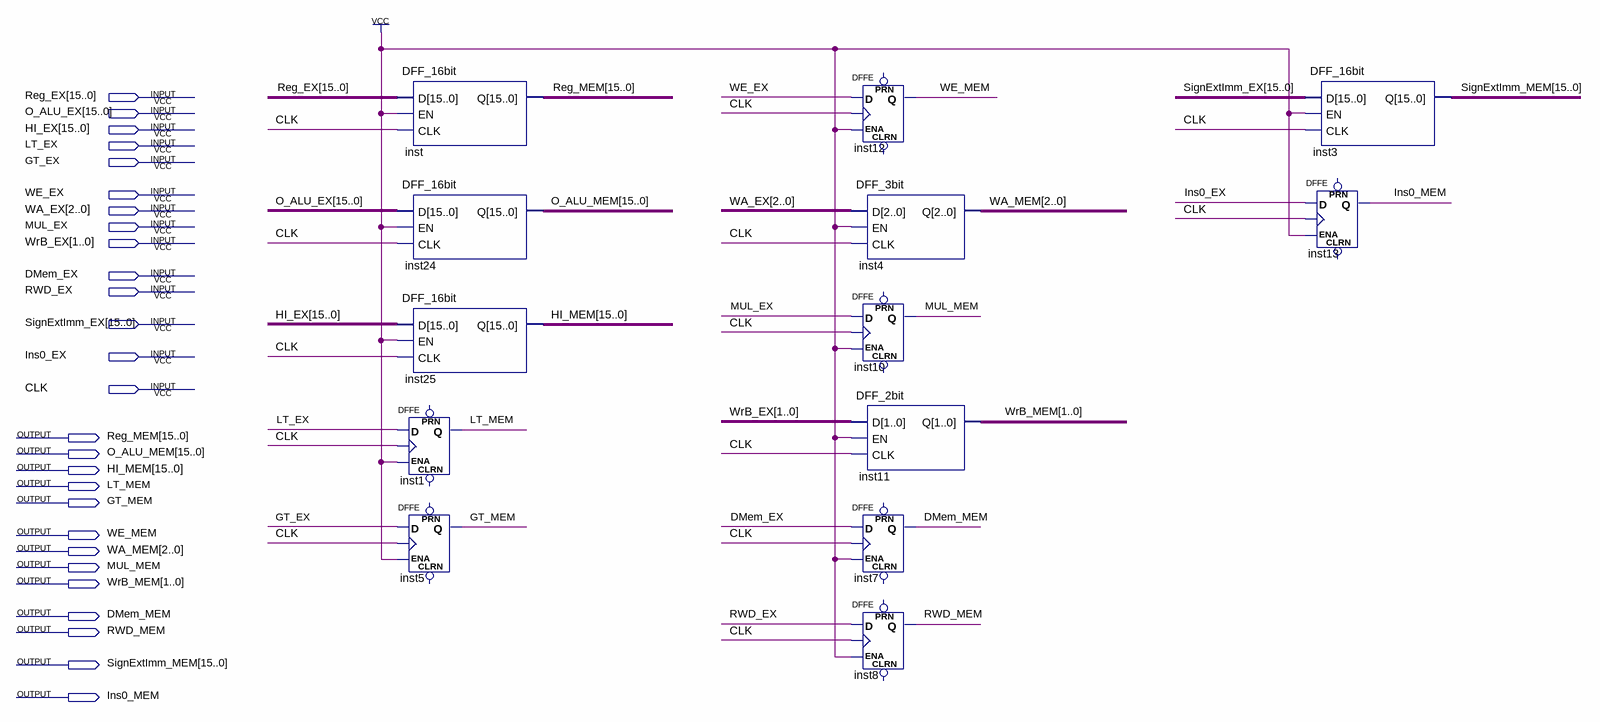
[diagram p0: schematic sheet]
// Quartus schematic EX_MEM.bdf as structural Verilog: 13 symbols, 27 pins
module EX_MEM (
  input  [15:0] Reg_EX,
  input  [15:0] O_ALU_EX,
  input  [15:0] HI_EX,
  input  LT_EX,
  input  GT_EX,
  input  WE_EX,
  input  [2:0] WA_EX,
  input  MUL_EX,
  input  [1:0] WrB_EX,
  input  DMem_EX,
  input  RWD_EX,
  input  [15:0] SignExtImm_EX,
  input  Ins0_EX,
  input  CLK,
  output [15:0] Reg_MEM,
  output [15:0] O_ALU_MEM,
  output [15:0] HI_MEM,
  output LT_MEM,
  output GT_MEM,
  output WE_MEM,
  output [2:0] WA_MEM,
  output MUL_MEM,
  output [1:0] WrB_MEM,
  output DMem_MEM,
  output RWD_MEM,
  output [15:0] SignExtImm_MEM,
  output Ins0_MEM
);

  DFF_16bit inst (.D(Reg_EX), .EN(1'b1), .CLK(CLK), .Q(Reg_MEM));
  DFF_16bit inst24 (.D(O_ALU_EX), .EN(1'b1), .CLK(CLK), .Q(O_ALU_MEM));
  DFF_16bit inst25 (.D(HI_EX), .EN(1'b1), .CLK(CLK), .Q(HI_MEM));
  DFFE inst1 (.D(LT_EX), .CLK(CLK), .ENA(1'b1), .Q(LT_MEM));  // open: PRN, CLRN
  DFFE inst5 (.D(GT_EX), .CLK(CLK), .ENA(1'b1), .Q(GT_MEM));  // open: PRN, CLRN
  DFFE inst12 (.D(WE_EX), .CLK(CLK), .ENA(1'b1), .Q(WE_MEM));  // open: PRN, CLRN
  DFF_3bit inst4 (.D(WA_EX), .EN(1'b1), .CLK(CLK), .Q(WA_MEM));
  DFFE inst10 (.D(MUL_EX), .CLK(CLK), .ENA(1'b1), .Q(MUL_MEM));  // open: PRN, CLRN
  DFF_2bit inst11 (.D(WrB_EX), .EN(1'b1), .CLK(CLK), .Q(WrB_MEM));
  DFFE inst7 (.D(DMem_EX), .CLK(CLK), .ENA(1'b1), .Q(DMem_MEM));  // open: PRN, CLRN
  DFFE inst8 (.D(RWD_EX), .CLK(CLK), .ENA(1'b1), .Q(RWD_MEM));  // open: PRN, CLRN
  DFF_16bit inst3 (.D(SignExtImm_EX), .EN(1'b1), .CLK(CLK), .Q(SignExtImm_MEM));
  DFFE inst13 (.D(Ins0_EX), .CLK(CLK), .ENA(1'b1), .Q(Ins0_MEM));  // open: PRN, CLRN
endmodule
